# Altium schematic sheet FMC connector.SchDoc: SAMTEC VITA 57
size 209 x 297 mm; CompanyName: CERN; DrawnBy: GK; Organization: CERN; Address1: European Organization for Nuclear Research; Address2: CH-1211 Geneve 23 - Switzerland; DocumentNumber: 1; Revision: -; SheetNumber: 3; SheetTotal: 9; EDA_Number: EDA-XXXXX-XX-X; Projet: FMC Delay 1ns 4cha; ModifiedBy: -; CheckedDate: -; Title2: Low Pin Count Connector; DivGrp: BE-CO; Designer: GK; ModifiedDate: -
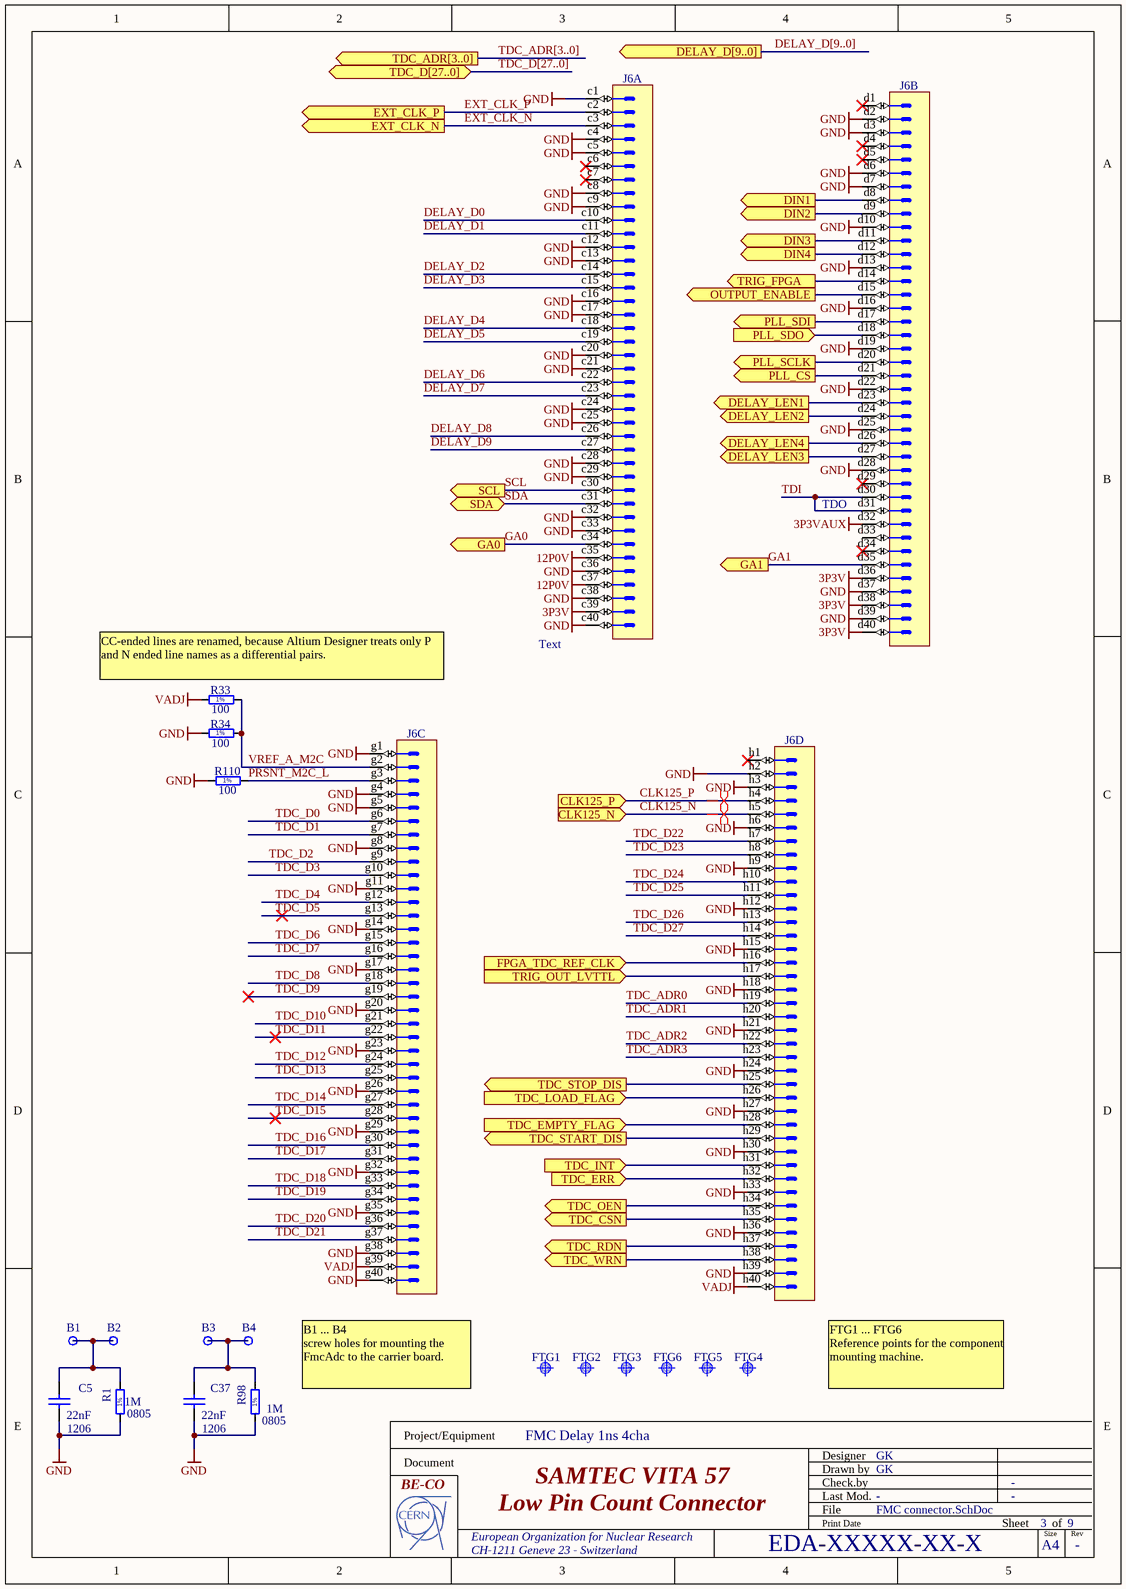
[diagram p0: FMC connector.SchDoc]

## Parts
B1  Plated Hole  [MTG300_600]  (value not drawn)
B2  Plated Hole  [MTG300_600]  (value not drawn)
B3  Plated Hole  [MTG300_600]  (value not drawn)
B4  Plated Hole  [MTG300_600]  (value not drawn)
C5  22nF  Case: 1206  [CAPC3216X140N]
C37  22nF  Case: 1206  [CAPC3216X140N]
FTG1  Use only in PCB  [FIDUCIAL_TOP_S100-200]  (value not drawn)
FTG2  Use only in PCB  [FIDUCIAL_TOP_S100-200]  (value not drawn)
FTG3  Use only in PCB  [FIDUCIAL_TOP_S100-200]  (value not drawn)
FTG4  Use only in PCB  [FIDUCIAL_TOP_S100-200]  (value not drawn)
FTG5  Use only in PCB  [FIDUCIAL_TOP_S100-200]  (value not drawn)
FTG6  Use only in PCB  [FIDUCIAL_TOP_S100-200]  (value not drawn)
J6  VITA 57  [SAMTEC_ASP-127797-01]  (value not drawn)  (parts A,B,C,D of 4)
R1  1M  Case: 0805  [RESC2012X60N]
R33  100  [RESC1608X55N]
R34  100  [RESC1608X55N]
R98  1M  Case: 0805  [RESC2012X60N]
R110  100  [RESC1608X55N]

## Ports
CLK125_N (in), CLK125_P (in), DELAY_D[9..0] (out), DELAY_LEN1 (out), DELAY_LEN2 (out), DELAY_LEN3 (out), DELAY_LEN4 (out), DIN1 (out), DIN2 (out), DIN3 (out), DIN4 (out), EXT_CLK_N (out), EXT_CLK_P (out), FPGA_TDC_REF_CLK (in), GA0 (out), GA1 (out), OUTPUT_ENABLE (out), PLL_CS (out), PLL_SCLK (out), PLL_SDI (out), PLL_SDO (in), SCL (out), SDA (bidir), TDC_ADR[3..0] (out), TDC_CSN (out), TDC_D[27..0] (bidir), TDC_EMPTY_FLAG (in), TDC_ERR (in), TDC_INT (in), TDC_LOAD_FLAG (in), TDC_OEN (out), TDC_RDN (out), TDC_START_DIS (out), TDC_STOP_DIS (out), TDC_WRN (out), TRIG_FPGA (out), TRIG_OUT_LVTTL (in)

## Nets
3P3V: J6.c39 J6.d36 J6.d38 J6.d40
3P3VAUX: J6.d32
12P0V: J6.c35 J6.c37
GND: C5.2 C37.2 J6.c1 J6.c4 J6.c5 J6.c8 J6.c9 J6.c12 J6.c13 J6.c16 J6.c17 J6.c20 J6.c21 J6.c24 J6.c25 J6.c28 J6.c29 J6.c32 J6.c33 J6.c36 J6.c38 J6.c40 J6.d2 J6.d3 J6.d6 J6.d7 J6.d10 J6.d13 J6.d16 J6.d19 J6.d22 J6.d25 J6.d28 J6.d37 J6.d39 J6.g1 J6.g4 J6.g5 J6.g8 J6.g11 J6.g14 J6.g17 J6.g20 J6.g23 J6.g26 J6.g29 J6.g32 J6.g35 J6.g38 J6.g40 J6.h2 J6.h3 J6.h6 J6.h9 J6.h12 J6.h15 J6.h18 J6.h21 J6.h24 J6.h27 J6.h30 J6.h33 J6.h36 J6.h39 R1.1 R34.1 R98.1 R110.1
VADJ: J6.g39 J6.h40 R33.1
CLK125_N: J6.h5 ; port CLK125_N
CLK125_P: J6.h4 ; port CLK125_P
DELAY_D0: J6.c10
DELAY_D1: J6.c11
DELAY_D2: J6.c14
DELAY_D3: J6.c15
DELAY_D4: J6.c18
DELAY_D5: J6.c19
DELAY_D6: J6.c22
DELAY_D7: J6.c23
DELAY_D8: J6.c26
DELAY_D9: J6.c27
DELAY_LEN1: J6.d23 ; port DELAY_LEN1
DELAY_LEN2: J6.d24 ; port DELAY_LEN2
DELAY_LEN3: J6.d27 ; port DELAY_LEN3
DELAY_LEN4: J6.d26 ; port DELAY_LEN4
DIN1: J6.d8 ; port DIN1
DIN2: J6.d9 ; port DIN2
DIN3: J6.d11 ; port DIN3
DIN4: J6.d12 ; port DIN4
EXT_CLK_N: J6.c3 ; port EXT_CLK_N
EXT_CLK_P: J6.c2 ; port EXT_CLK_P
FPGA_TDC_REF_CLK: J6.h16 ; port FPGA_TDC_REF_CLK
GA0: J6.c34 ; port GA0
GA1: J6.d35 ; port GA1
OUTPUT_ENABLE: J6.d15 ; port OUTPUT_ENABLE
PLL_CS: J6.d21 ; port PLL_CS
PLL_SCLK: J6.d20 ; port PLL_SCLK
PLL_SDI: J6.d17 ; port PLL_SDI
PLL_SDO: J6.d18 ; port PLL_SDO
PRSNT_M2C_L: J6.g3 R110.2
SCL: J6.c30 ; port SCL
SDA: J6.c31 ; port SDA
TDC_ADR0: J6.h19
TDC_ADR1: J6.h20
TDC_ADR2: J6.h22
TDC_ADR3: J6.h23
TDC_CSN: J6.h35 ; port TDC_CSN
TDC_D0: J6.g6
TDC_D1: J6.g7
TDC_D2: J6.g9
TDC_D3: J6.g10
TDC_D4: J6.g12
TDC_D5: J6.g13
TDC_D6: J6.g15
TDC_D7: J6.g16
TDC_D8: J6.g18
TDC_D9: J6.g19
TDC_D10: J6.g21
TDC_D11: J6.g22
TDC_D12: J6.g24
TDC_D13: J6.g25
TDC_D14: J6.g27
TDC_D15: J6.g28
TDC_D16: J6.g30
TDC_D17: J6.g31
TDC_D18: J6.g33
TDC_D19: J6.g34
TDC_D20: J6.g36
TDC_D21: J6.g37
TDC_D22: J6.h7
TDC_D23: J6.h8
TDC_D24: J6.h10
TDC_D25: J6.h11
TDC_D26: J6.h13
TDC_D27: J6.h14
TDC_EMPTY_FLAG: J6.h28 ; port TDC_EMPTY_FLAG
TDC_ERR: J6.h32 ; port TDC_ERR
TDC_INT: J6.h31 ; port TDC_INT
TDC_LOAD_FLAG: J6.h26 ; port TDC_LOAD_FLAG
TDC_OEN: J6.h34 ; port TDC_OEN
TDC_RDN: J6.h37 ; port TDC_RDN
TDC_START_DIS: J6.h29 ; port TDC_START_DIS
TDC_STOP_DIS: J6.h25 ; port TDC_STOP_DIS
TDC_WRN: J6.h38 ; port TDC_WRN
TDI: J6.d30 J6.d31
TRIG_FPGA: J6.d14 ; port TRIG_FPGA
TRIG_OUT_LVTTL: J6.h17 ; port TRIG_OUT_LVTTL
VREF_A_M2C: J6.g2 R33.2 R34.2
NetB1_1: B1.1 B2.1 C5.1 R1.2
NetB3_1: B3.1 B4.1 C37.1 R98.2

Not connected (* = marked no-connect by the designer): J6 c6* c7* d1* d4* d5* d29* d33 d34* h1*

## Buses and harness runs
bus DELAY_D[9..0] = port DELAY_D[9..0]
bus TDC_ADR[3..0] = port TDC_ADR[3..0]
bus TDC_D[27..0] = port TDC_D[27..0]

## Layout directives
differential pair: CLK125_N, CLK125_P

## Notes on the sheet
- (near J6) TDO
- (near J6) Text
- (near R33) CC-ended lines are renamed, because Altium Designer treats only P and N ended line names as a differential pairs.
- B1 ... B4
  screw holes for mounting the FmcAdc to the carrier board.
- FTG1 ... FTG6
  Reference points for the component mounting machine.
- Project/Equipment
- Document
- Designer
- Drawn by
- Check.by
- File
- Last Mod.
- Print Date
- Sheet
- Size
- A4
- of
- Rev
- (in symbol R0603_100R_1%_0.1W_100PPM) 1%
- (in symbol R0805_1M_1%_0.125W_100PPM) 1%

## Library data of the parts
B1-B4 = PLATED_HOLE3.0_PAD6.0: Single Terminal Socket; Part Description: Plated Through Hole: Hole Dia.=3.0mm Pad Dia.=6.0mm; Mounted: No; Table: Pads; Part Number: PLATED_HOLE3.0_PAD6.0; Component Kind: Standard (No BOM); Component Type: Standard (No BOM); Designator: Single Terminal Socket; Library Reference: Single Terminal Socket; Pin Count: 1; Family: Plated Hole; Socket: No; SMD: No; Status: None; ComponentHeight: 0mm; Author: CERN DEM JLC; CreateDate: 26.05.2008; LatestRevisionDate: 26.05.2008; PackageDescription: Plated Through Hole: Hole Dia.=3.0mm Pad Dia.=6.0mm
C5 C37 = CC1206_22NF_200V_10%_X7R: Non-polarised capacitor; Part Description: SMD Multilayer Chip Ceramic Capacitor; Manufacturer: GENERIC; Manufacturer1 Part Number: 223893115641; Voltage: 200V; TC: X7R; Tolerance: ±10%; Table: Capacitors SMD; Part Number: CC1206_22NF_200V_10%_X7R; Component Kind: Standard; Component Type: Standard; Pin Count: 2; Value: 22nF; Status: Preferred; Manufacturer Part Number: CC1206_22NF_200V_10%_X7R; Mounted: Yes; Socket: No; SMD: Yes; HelpURL: \\cern.ch\dfs\Applications\Altium\Datasheets\CC1206_X7R_PHYCOMP.pdf; Author: CERN DEM JLC; CreateDate: 24.08.2009; LatestRevisionDate: 24.08.2009; Manufacturer1 Example: PHYCOMP; Manufacturer1 ComponentHeight: 1.25mm
FTG1-FTG6 = FIDUCIAL_TARGET_S100-200: Fiducial Target; Part Description: Scare Fiducial Target, Top Layer, 1.0mm, Top Sloder 2.0mm, Keepout =2.0mm; Mounted: No; Table: Pads; Part Number: FIDUCIAL_TARGET_S100-200; Component Kind: Standard (No BOM); Component Type: Standard (No BOM); Pin Count: 1; Family: Fiducial; Socket: No; SMD: Yes; Status: None; ComponentHeight: 0mm; Author: CERN DEM JLC; CreateDate: 09.02.2010; LatestRevisionDate: 09.02.2010; PackageDescription: Scare Fiducial Target, Top Layer, 1.0mm, Top Sloder 2.0mm, Keepout =2.0mm
J6 = SAMTEC_ASP-127797-01: Connector VITA 57, 160 Male contacts in 4 row cdgh; Part Description: 160 contacts (4 rows cdgh) Surface Mount Male Connector, VITA 57; Manufacturer: SAMTEC; Manufacturer Part Number: ASP-134488-01; Part Number: SAMTEC_ASP-127797-01; Component Kind: Standard; Component Type: Standard; Pin Count: 160; Family: VITA 57; Mounted: Yes; Socket: No; SMD: Yes; Status: None; ComponentHeight: 6.1mm; HelpURL: \\cern.ch\dfs\Applications\Altium\Datasheets\SAMTEC_ASP-127797-01.pdf; Author: CERN DEM JLC; CreateDate: 2009-09-24; LatestRevisionDate: 2009-09-24; Table: SAMTEC
R1 R98 = R0805_1M_1%_0.125W_100PPM: Resistor - 1%; Part Description: General Purpose Thick Film Chip Resistor; Manufacturer: GENERIC; Manufacturer1 Part Number: NRC10F1004TRF; Manufacturer1 Datasheet: \\cern.ch\dfs\Applications\Altium\Datasheets\R0805_NIC_NRC.pdf; Power: 0.125W; TC: ±100ppm/°C; Table: Resistors SMD; Part Number: R0805_1M_1%_0.125W_100PPM; Component Kind: Standard; Component Type: Standard; Designator: Resistor - 1%; Library Reference: Resistor - 1%; Pin Count: 2; Value: 1M; Status: Preferred; Tolerance: ±1%; Manufacturer Part Number: R0805_1M_1%_0.125W_100PPM; Mounted: Yes; Socket: No; SMD: Yes; Manufacturer1 Example: NIC COMPONENT; Manufacturer1 ComponentHeight: 0.6mm; HelpURL: \\cern.ch\dfs\Applications\Altium\Datasheets\R0805_NIC_NRC.pdf; Author: CERN DEM JLC; CreateDate: 12/3/2007; LatestRevisionDate: 3/13/2008
R33 R34 R110 = R0603_100R_1%_0.1W_100PPM: Resistor - 1%; Part Description: General Purpose Thick Film Chip Resistor; Manufacturer: GENERIC; Manufacturer1 Part Number: NRC06F4700TRF; Power: 0.1W; TC: ±100ppm/°C; Table: Resistors SMD; Part Number: R0603_100R_1%_0.1W_100PPM; Component Kind: Standard; Component Type: Standard; Pin Count: 2; Value: 100; Status: Preferred; Tolerance: ±1%; Manufacturer Part Number: R0603_100R_1%_0.1W_100PPM; Case: 0603; Mounted: Yes; Socket: No; SMD: Yes; Manufacturer1 Example: NIC COMPONENT; Manufacturer1 ComponentHeight: 0.55mm; HelpURL: \\cern.ch\dfs\Applications\Altium\Datasheets\R0603_NIC_NRC.pdf; Author: CERN DEM JLC; CreateDate: 2007-12-03; LatestRevisionDate: 2008-03-13